# EAGLE design Grove - 3-axis digital accelerometer (EAGLE 6.1)
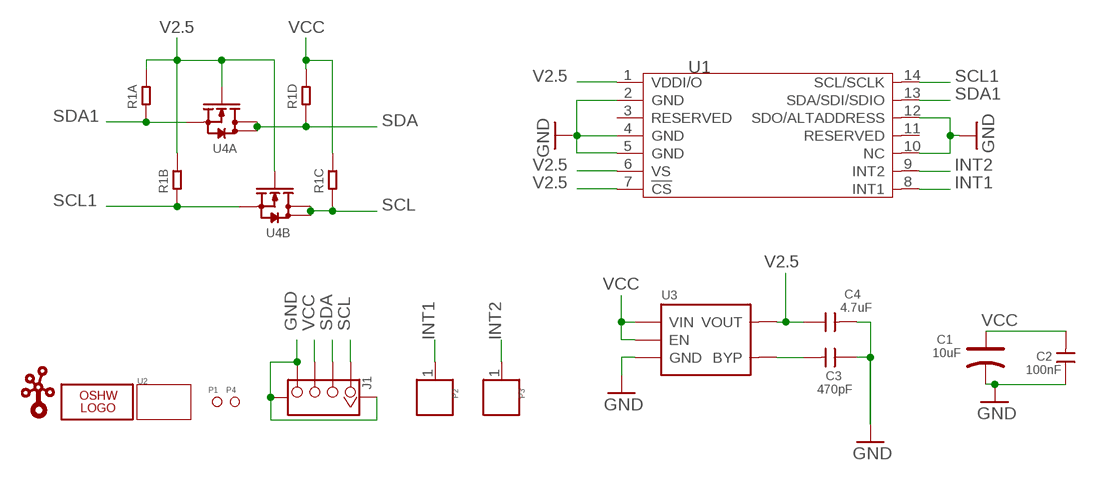
[diagram p0: schematic, sheet 1]

## Parts
C1  10uF  CAP-AVX-A  [AVX-A]
C2  100nF  C-0603  [0603]
C3  470pF  C-0603  [0603]
C4  4.7uF  C-0603  [0603]
J1  TWIG-4P-2.0-SMD-FEMALE-REINFORCE'DD'  [4P-SMD-2.0]
LOGO1  LOGO-OSHW-6MILX0200-NT  [OSHW_6X200_NOTEXT]
P1  PAD-MARK  [ROUND-MARK-0.635]
P2  PAD'60/30'  [1P-65/35MIL]
P3  PAD'60/30'  [1P-65/35MIL]
P4  PAD-MARK  [ROUND-MARK-0.635]
R1  R-4R-1206  [1206-8-3.3X2.4]
U1  ADXL345  [LGA14]
U2  TWIG-1U  [1U-DIM-W/-DRILL]
U3  MIC5205  [SOT23-5]
U4  MOSFET-DUAL-N-1206-8  [1206-8]
U$1  LOGO-TWIGTWIGLOGO_SMALL  [TWIGLOGO_SMALL]

## Nets
GND: C1.- C2.1 C3.1 C4.2 J1.4 J1.SS1 J1.SS2 U1.2(GND) U1.4(GND) U1.5(GND) U1.10(NC) U1.12(SDO/ALTADDRESS) U3.2(GND)
INT1: P2.1 U1.8(INT1)
INT2: P3.1 U1.9(INT2)
N$4: C3.2 U3.4(BYP)
SCL: J1.1 R1.3 U4.5(B:D) U4.6(B:D)
SCL1: R1.2 U1.14(SCL/SCLK) U4.3(B:S)
SDA: J1.2 R1.4 U4.7(A:D) U4.8(A:D)
SDA1: R1.1 U1.13(SDA/SDI/SDIO) U4.1(A:S)
V2.5: C4.1 R1.7 R1.8 U1.1(VDDI/O) U1.6(VS) U1.7(!CS) U3.5(VOUT) U4.2(A:G) U4.4(B:G)
VCC: C1.+ C2.2 J1.3 R1.5 R1.6 U3.1(VIN) U3.3(EN)
Unconnected: U1.3(RESERVED) U1.11(RESERVED)

## Library data of the parts
C1 = Discrete:CAP*: Electrolytic Capacitors,Tantalum Capacitors and Super Capacitors
C2-C4 = Discrete:C*: Ceramic Capacitors
J1 = Connector:TWIG-4P-2.0-SMD-FEMALE-REINFORCE
LOGO1 = Logo:LOGO-OSHW-6MIL
P1 P4 = Discrete:PAD-MARK
P2 P3 = Discrete:PAD
R1 = Discrete:R-4R*: Resistor Array
U1 = IC:ADXL345: 3-Axis,+/-2g / +/-4g / +/-8g / +/-16g Digital Accelerometer
U2 = Module:TWIG
U3 = IC:MIC5205: The MIC5205 is an efficient linear voltage regulator with ultra-low-noise output, very low dropout voltage (typically 17mV at light loads and 165mV at 150mA), and very low ground current (600µA at 100mA output). The MIC5205 offers better than 1% initial accuracy. datasheet here: http://www.micrel.com/product-info/prod/5205.shtml
U4 = Discrete:MOSFET-DUAL-N: Si5902BDC/Si5904DC/Si5908DC/Si5920DC
U$1 = Logo:LOGO-TWIG

## Board
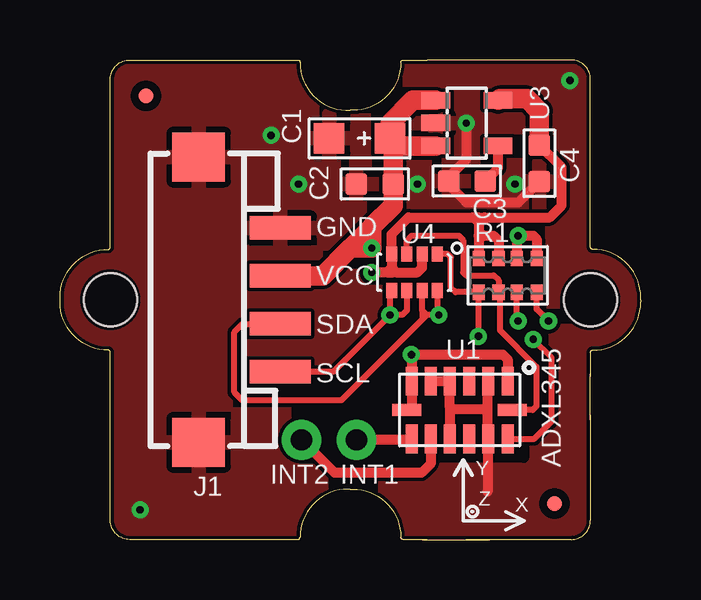
[diagram p1: board, top side]
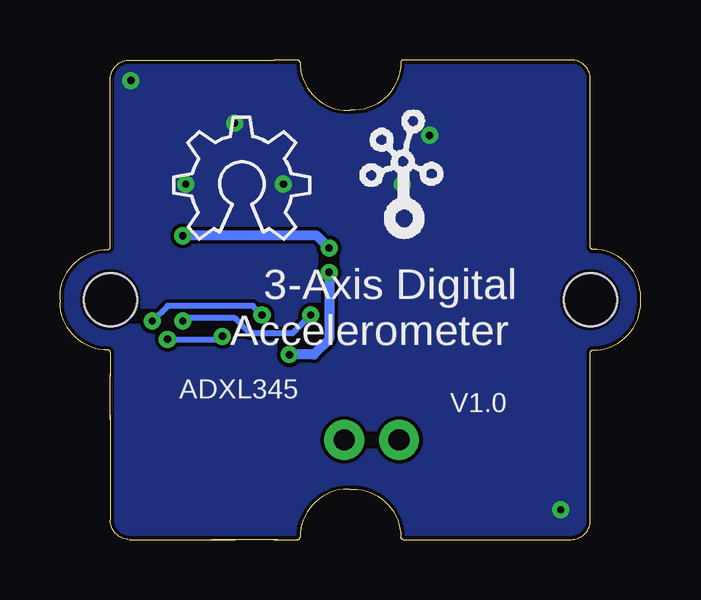
[diagram p2: board, bottom side, seen from below]

Size 24.2 x 20 mm. Coordinates in mm from the lower left corner, seen from the top.
Copper layers (1*16): Top 0.035mm / dielectric 1.5mm / Bottom 0.035mm
Design rules: minimum track width 8mil, minimum drill 8mil, track to track 6mil, track to pad 6mil, pad to pad 6mil, via to via 6mil, smd to smd 6mil, copper to edge 6mil, drill to drill 6mil, minimum pad ring 10mil, minimum via ring 8mil, stop-mask expansion 4mil, vias tented up to drill 25mil, thermal gap 10mil
tRestrict: area 14,3.4 to 19.3,7.2

### Footprints (pad centres in the part's own frame; a part is rotated, then mirrored left to right if it is on the bottom)
AVX-A = smd 1.27 x 1.27: + -1.27,0; - 1.27,0
0603 = smd 0.889 x 0.889: 1 -0.762,0; 2 0.762,0
4P-SMD-2.0 = smd 0.965 x 2.54: 1 -3,0; 2 -1,0; 3 1,0; 4 3,0 | smd 2.032 x 2.184: SS1 -5.946,3.4; SS2 5.946,3.4
ROUND-MARK-0.635 = smd 0.635 x 0.635: P$1 0,0
1P-65/35MIL = drill 0.889 pad 1.651: 1 0,0
1206-8-3.3X2.4 = smd 0.508 x 0.635: 1 -1.206,-0.699; 2 -0.381,-0.699; 3 0.381,-0.699; 4 1.206,-0.699; 5 1.206,0.699; 6 0.381,0.699; 7 -0.381,0.699; 8 -1.206,0.699
LGA14 = smd 1.2 x 0.5: 1 -1.2,2; 2 -1.2,1.2; 3 -1.2,0.4; 4 -1.2,-0.4; 5 -1.2,-1.2; 6 -1.2,-2; 8 1.2,-2; 9 1.2,-1.2; 10 1.2,-0.4; 11 1.2,0.4; 12 1.2,1.2; 13 1.2,2 | smd 0.5 x 1.2: 7 0,-2.2; 14 0,2.2
1U-DIM-W/-DRILL = hole 2.2: 0,-10; 0,10
SOT23-5 = smd 0.69 x 1.2: 1 -0.95,-1.3; 2 0,-1.3; 3 0.95,-1.3; 4 0.95,1.3; 5 -0.95,1.3
1206-8 = smd 0.457 x 0.635: 1 -0.953,-0.762; 2 -0.318,-0.762; 3 0.318,-0.762; 4 0.953,-0.762; 5 0.953,0.762; 6 0.318,0.762; 7 -0.318,0.762; 8 -0.953,0.762

### Placement (x,y rotation side)
C1  12.48,16.73 180 top
C2  13.12,14.83 0 top
C3  16.95,14.95 0 top
C4  19.97,15.69 270 top
J1  9.18,10 90 top
LOGO1  19.47,12.54 0 bottom
P1  20.61,1.49 270 top
P2  12.35,4.16 270 top
P3  10.07,4.16 270 top
P4  3.59,18.51 0 top
R1  18.65,11.02 0 top
U1  16.65,5.4 270 top
U2  12.1,10 90 top
U3  16.95,17.37 270 top
U4  14.77,11.14 180 top
U$1  12.1,12.41 0 bottom

### Tracks (layer width: path | path; a pad name or v marks a point on that pad's centre or on a via)
GND  (via drill 0.3)
  Top 0.406: C3.1 16.19,14.8 16.93,14.06 19.11,14.06 C4.2 | v16.93,17.37 16.93,15.84 16.16,15.08 | U1.5 U1.4 16.25,5.51 | U1.2 17.81,6.57 17.81,5.3 | 17.81,4.23 17.81,4.29 17.81,5.3 | 17.81,4.23 U1.12 | 17.81,5.3 17.69,5.43 16.33,5.43 16.25,5.51 | 16.25,5.51 U1.10 | 17.81,4.23 17.81,2
  other vias: 3.34,1.24 21.24,19.14 14.89,14.83 9.94,14.83 8.8,16.86 18.96,14.83
  pour Bottom: -0.98,23.34 25.18,23.34 25.18,-3.34 -0.98,-3.34
  pour Top: -0.98,23.34 25.18,23.34 25.18,-3.34 -0.98,-3.34
INT1
  Top 0.406: P2.1 14.65,4.16 U1.8
INT2
  Top 0.406: U1.9 15.45,3.16 15.07,2.79 11.44,2.79 P3.1
N$4
  Top 0.406: U3.4 18.25,15.49 C3.2
SCL  (via drill 0.3)
  Top 0.254: R1.3 19.03,9.16 v19.09,9.11 | v13.75,9.37 13.75,10.32 U4.5 | v13.75,9.37 11.39,7 J1.1 | U4.6 14.45,9.55 14.26,9.37 v13.75,9.37
  Bottom 0.254: v19.09,9.11 18.96,9.24 16.93,9.24 16.29,8.6 14.51,8.6 v13.75,9.37
SCL1
  Top 0.254: U4.3 14.45,12.48 14.64,12.67 16.62,12.67 16.8,12.49 16.8,11.14 16.93,11.02 18.07,11.02 18.27,10.81 R1.2 18.32,10.27 18.32,8.73 19.85,7.21 19.85,5.55 19.7,5.4 U1.14 19.31,5.4
SDA  (via drill 0.3)
  Top 0.254: 15.78,10.32 U4.8 15.72,9.43 v15.78,9.37 15.27,9.37 | J1.2 9.16,8.98 7.59,8.98 7.26,8.65 7.26,6.14 7.59,5.81 11.72,5.81 15.08,9.17 | R1.4 19.86,9.61 v20.36,9.11 | 15.08,9.55 U4.7 | 15.27,9.37 15.08,9.55 | 15.27,9.37 15.08,9.17 | 15.08,9.55 15.08,9.17
  Bottom 0.254: v20.36,9.11 19.72,9.75 16.16,9.75 v15.78,9.37
SDA1  (via drill 0.3)
  Top 0.254: U1.13 19.77,4.2 20.48,4.92 20.48,7.59 v19.72,8.35 | v17.43,8.48 17.45,8.49 R1.1 16.48,10.32 16.29,10.51 16.29,11.78 16.16,11.9 U4.1
  Bottom 0.254: v19.72,8.35 17.56,8.35 v17.43,8.48
V2.5  (via drill 0.3 pad 0.64)
  Top 0.305: 17.43,12.41 17.69,12.67 17.43,12.92 17.43,13.18 | 17.18,13.43 17.43,13.18 | 17.43,13.43 17.43,13.18 | 17.43,13.18 17.69,13.43
  Top 0.406: U1.7 14.65,5.6 U1.6 v14.65,7.71 v14.64,7.71 18.45,7.71 18.65,7.52 U1.1 | 18.32,11.77 R1.7 18.27,12.46 18.07,12.67 17.69,12.67 17.45,12.67 | U4.2 15.08,11.33 14.89,11.14 14,11.14 | 14,11.14 13.88,11.14 | 13.81,11.33 U4.4 13.81,12.73 14.51,13.43 17.18,13.43 17.43,13.43 | 13.81,11.33 13.81,11.21 13.88,11.14 | 20.13,16.45 C4.1 20.9,15.52 20.9,13.93 20.4,13.43 17.69,13.43 17.43,13.43 | 13.62,11.14 13.88,11.14 | 13.62,11.14 v12.99,11.14 | 17.43,11.73 R1.8 17.45,12.67 | 17.45,12.67 17.45,13.42 17.43,13.43 | 13.81,11.33 14,11.14 | 13.81,11.33 13.62,11.14
  Top 0.813: C4.1 19.97,17.87 19.47,18.38 18.32,18.38 U3.5
  Bottom 0.406: v12.99,11.14 12.99,8.35 13.62,7.71 v14.64,7.71
VCC  (via drill 0.3 pad 0.64)
  Top 0.406: R1.6 19.03,12.62 v19.09,12.67 19.72,12.67 19.86,12.53 R1.5
  Top 0.813: J1.3 10.94,11 12.1,12.16 | 13.88,16.22 C2.2 13.88,13.94 12.99,13.05 | 13.88,16.22 13.88,16.6 C1.+ 13.75,17.37 14.7,18.32 U3.1 | U3.3 14.07,16.42 13.88,16.22 | 12.1,12.16 v12.99,12.16 12.99,13.05 | 12.1,12.16 12.99,13.05
  Bottom 0.406: v19.09,12.67 13.5,12.67 v12.99,12.16

### Text on the board
tPlace: GND | VCC | SDA | SCL
bPlace: 3-Axis Digital | Accelerometer | ADXL345 | V1.0
tNames: INT2 | INT1 | Y | ADXL345 | Z | X